# EAGLE design 8x LED Trieber Stage_01 (EAGLE 6.5.0)
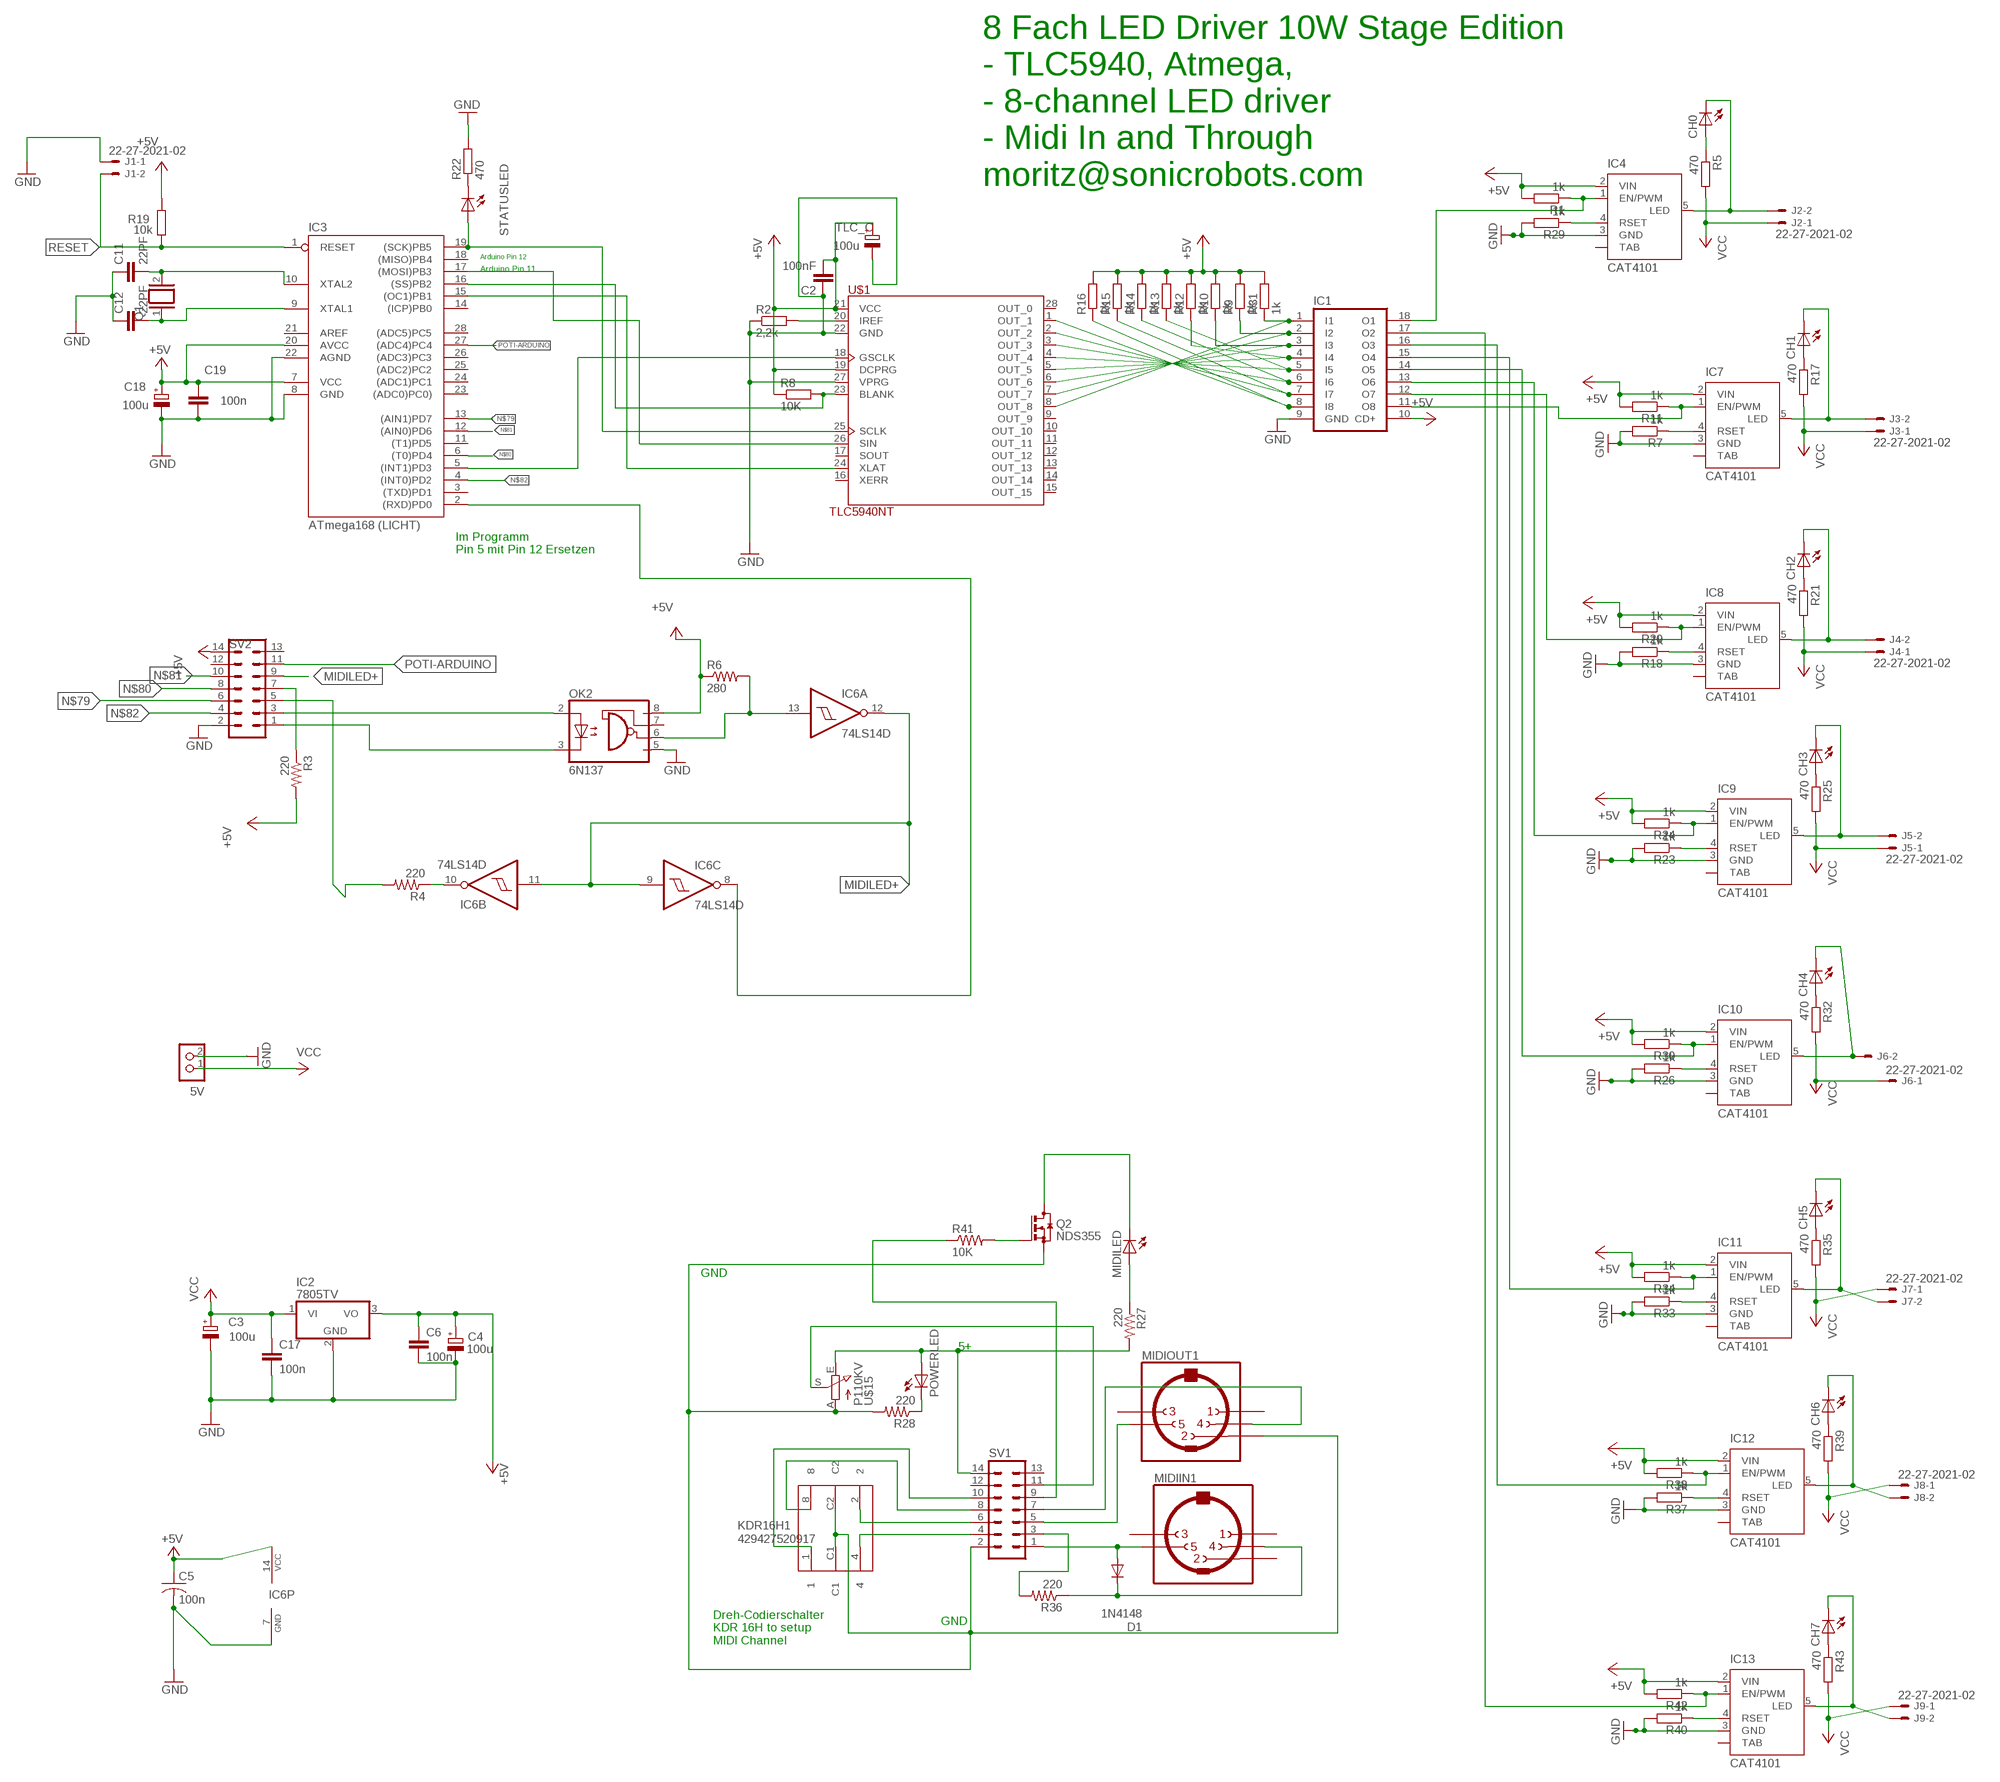
[diagram p0: schematic, sheet 1]

## Parts
5V  5V  CON_TERMINAL_BLOCK_02-5MM  [TERMINAL_BLOCK_2P_5]
C2  100nF  C-EUC0805  [C0805]
C3  100u  CPOL-EUE2.5-6  [E2,5-6]
C4  100u  CPOL-EUE2.5-6  [E2,5-6]
C5  100n  C-USC0805  [C0805]
C6  100n  C-EUC0805K  [C0805K]
C11  22PF  C-EUC0805  [C0805]
C12  22PF  C-EUC0805  [C0805]
C17  100n  C-EUC0805K  [C0805K]
C18  100u  CPOL-EUE2.5-6  [E2,5-6]
C19  100n  C-EUC0805K  [C0805K]
CH0  LED3MM  [LED3MM]
CH1  LED3MM  [LED3MM]
CH2  LED3MM  [LED3MM]
CH3  LED3MM  [LED3MM]
CH4  LED3MM  [LED3MM]
CH5  LED3MM  [LED3MM]
CH6  LED3MM  [LED3MM]
CH7  LED3MM  [LED3MM]
D1  1N4148  DIODE-D-7.5  [D-7.5]
IC1  IC_ULN2803AN  [DIL18]
IC2  7805TV  [TO220V]
IC3  ATmega168 (LICHT)  AT90S4433P  [DIL28-3]
IC4  CAT4101  [TO263_5]
IC6  74LS14D  [SO14]
IC7  CAT4101  [TO263_5]
IC8  CAT4101  [TO263_5]
IC9  CAT4101  [TO263_5]
IC10  CAT4101  [TO263_5]
IC11  CAT4101  [TO263_5]
IC12  CAT4101  [TO263_5]
IC13  CAT4101  [TO263_5]
J1  22-27-2021-02  [6410-02]
J2  22-27-2021-02  [6410-02]
J3  22-27-2021-02  [6410-02]
J4  22-27-2021-02  [6410-02]
J5  22-27-2021-02  [6410-02]
J6  22-27-2021-02  [6410-02]
J7  22-27-2021-02  [6410-02]
J8  22-27-2021-02  [6410-02]
J9  22-27-2021-02  [6410-02]
KDR16H1  429427520917  [429427520917]
MIDIIN1  MAB5SH  [MAB5SH]
MIDILED  LED3MM  [LED3MM]
MIDIOUT1  MAB5SH  [MAB5SH]
OK2  6N137  [DIL08]
POWERLED  LED3MM  [LED3MM]
Q1  XTAL/S  [QS]
Q2  NDS355  BSS123  [SOT23]
R1  1k  R-EU_R0805W  [R0805W]
R2  2,2k  R-EU_R0805  [R0805]
R3  220  R-US_R0805  [R0805]
R4  220  R-US_R0805  [R0805]
R5  470  R-EU_M0805  [M0805]
R6  280  R-US_R0805  [R0805]
R7  1k  R-EU_R0805W  [R0805W]
R8  10K  R-EU_R0805  [R0805]
R9  1k  R-EU_R0805W  [R0805W]
R10  1k  R-EU_R0805W  [R0805W]
R11  1k  R-EU_R0805W  [R0805W]
R12  1k  R-EU_R0805W  [R0805W]
R13  1k  R-EU_R0805W  [R0805W]
R14  1k  R-EU_R0805W  [R0805W]
R15  1k  R-EU_R0805W  [R0805W]
R16  1k  R-EU_R0805W  [R0805W]
R17  470  R-EU_M0805  [M0805]
R18  1k  R-EU_R0805W  [R0805W]
R19  10k  R-EU_R0805  [R0805]
R20  1k  R-EU_R0805W  [R0805W]
R21  470  R-EU_M0805  [M0805]
R22  470  R-EU_M0805  [M0805]
R23  1k  R-EU_R0805W  [R0805W]
R24  1k  R-EU_R0805W  [R0805W]
R25  470  R-EU_M0805  [M0805]
R26  1k  R-EU_R0805W  [R0805W]
R27  220  R-US_R0805W  [R0805W]
R28  220  R-US_R0805  [R0805]
R29  1k  R-EU_R0805W  [R0805W]
R30  1k  R-EU_R0805W  [R0805W]
R31  1k  R-EU_R0805W  [R0805W]
R32  470  R-EU_M0805  [M0805]
R33  1k  R-EU_R0805W  [R0805W]
R34  1k  R-EU_R0805W  [R0805W]
R35  470  R-EU_M0805  [M0805]
R36  220  R-US_R0805  [R0805]
R37  1k  R-EU_R0805W  [R0805W]
R38  1k  R-EU_R0805W  [R0805W]
R39  470  R-EU_M0805  [M0805]
R40  1k  R-EU_R0805W  [R0805W]
R41  10K  R-US_R0805  [R0805]
R42  1k  R-EU_R0805W  [R0805W]
R43  470  R-EU_M0805  [M0805]
STATUSLED  LED3MM  [LED3MM]
SV1  ML14  [ML14]
SV2  ML14  [ML14]
TLC_C  100u  CPOL-EUE2.5-6  [E2,5-6]
U$1  TLC5940NT  [DIP-28]
U$15  P110KV  [POT-P110KV]

## Nets
+5V [power]: C2.2 C4.+ C5.1 C6.1 C18.+ C19.1 IC1.10(CD+) IC2.3(VO) IC3.7(VCC) IC3.20(AVCC) IC4.2(VIN) IC6.14(P:VCC) IC7.2(VIN) IC8.2(VIN) IC9.2(VIN) IC10.2(VIN) IC11.2(VIN) IC12.2(VIN) IC13.2(VIN) OK2.8(VCC) R1.2 R3.2 R6.1 R8.1 R9.2 R10.2 R11.2 R12.2 R13.2 R14.2 R15.2 R16.2 R19.2 R20.2 R24.2 R30.2 R31.2 R34.2 R38.2 R42.2 SV2.14 TLC_C.+ U$1.19(DCPRG) U$1.21(VCC)
GND [power]: 5V.2 C2.1 C3.- C4.- C5.2 C6.2 C11.1 C12.1 C17.2 C18.- C19.2 IC1.9(GND) IC2.2(GND) IC3.8(GND) IC3.22(AGND) IC4.3(GND) IC6.7(P:GND) IC7.3(GND) IC8.3(GND) IC9.3(GND) IC10.3(GND) IC11.3(GND) IC12.3(GND) IC13.3(GND) J1.1 OK2.5(GND) R2.1 R7.2 R18.2 R22.2 R23.2 R26.2 R29.2 R33.2 R37.2 R40.2 SV2.2 TLC_C.- U$1.22(GND) U$1.27(VPRG)
MIDI-2: IC3.2((RXD)PD0) IC6.8(C:O)
MIDI_IN2: R41.1 SV1.9
MIDILED+: IC6.9(C:I) IC6.11(B:I) IC6.12(A:O) SV2.9
MIDILED+1: MIDILED.K(C) Q2.3(D)
N$1: OK2.3(C) SV2.1
N$2: IC6.13(A:I) OK2.6(VO) R6.2
N$3: IC1.1(I1) R31.1 U$1.8(OUT_8)
N$4: IC3.19((SCK)PB5) STATUSLED.A U$1.25(SCLK)
N$5: IC1.2(I2) R9.1 U$1.7(OUT_7)
N$6: IC1.3(I3) R10.1 U$1.6(OUT_6)
N$7: IC1.4(I4) R12.1 U$1.5(OUT_5)
N$8: IC3.17((MOSI)PB3) U$1.26(SIN)
N$9: IC3.16((SS)PB2) R8.2 U$1.23(BLANK)
N$10: IC7.4(RSET) R7.1
N$12: IC1.5(I5) R13.1 U$1.4(OUT_4)
N$13: IC1.6(I6) R14.1 U$1.3(OUT_3)
N$14: IC1.7(I7) R15.1 U$1.2(OUT_2)
N$15: IC3.15((OC1)PB1) U$1.24(XLAT)
N$16: IC1.11(O8) IC7.1(EN/PWM) R11.1
N$17: IC3.5((INT1)PD3) U$1.18(GSCLK)
N$18: IC1.8(I8) R16.1 U$1.1(OUT_1)
N$19: D1.A MIDIIN1.5 SV1.1
N$20: R2.2 U$1.20(IREF)
N$21: KDR16H1.1 SV1.10
N$22: C12.2 IC3.9(XTAL1) Q1.1
N$23: MIDILED.A R27.1
N$24: CH1.K(C) IC7.5(LED) J3.2
N$25: C11.2 IC3.10(XTAL2) Q1.2
N$26: R3.1 SV2.7
N$27: R22.1 STATUSLED.K(C)
N$29: IC4.4(RSET) R29.1
N$30: CH0.A R5.1
N$31: IC1.18(O1) IC4.1(EN/PWM) R1.1
N$32: IC6.10(B:O) R4.1
N$33: R4.2 SV2.5
N$34: SV1.11 U$15.S
N$35: D1.C MIDIIN1.4 R36.1
N$36: CH0.K(C) IC4.5(LED) J2.2
N$37: POWERLED.K(C) R28.1
N$38: CH1.A R17.1
N$39: IC8.4(RSET) R18.1
N$41: IC1.12(O7) IC8.1(EN/PWM) R20.1
N$42: CH2.K(C) IC8.5(LED) J4.2
N$43: MIDIOUT1.5 SV1.5
N$44: CH2.A R21.1
N$45: IC9.4(RSET) R23.1
N$47: IC1.13(O6) IC9.1(EN/PWM) R24.1
N$49: OK2.2(A) SV2.3
N$50: CH3.K(C) IC9.5(LED) J5.2
N$51: MIDIOUT1.4 SV1.7
N$52: CH3.A R25.1
N$53: IC10.4(RSET) R26.1
N$55: IC1.14(O5) IC10.1(EN/PWM) R30.1
N$56: CH4.K(C) IC10.5(LED) J6.2
N$57: CH4.A R32.1
N$58: IC11.4(RSET) R33.1
N$61: KDR16H1.4 SV1.4
N$62: IC1.15(O4) IC11.1(EN/PWM) R34.1
N$63: KDR16H1.8 SV1.8
N$64: KDR16H1.2 SV1.6
N$65: CH5.K(C) IC11.5(LED) J7.2
N$66: CH5.A R35.1
N$67: POWERLED.A R27.2 SV1.14 U$15.E
N$68: IC12.4(RSET) R37.1
N$70: IC1.16(O3) IC12.1(EN/PWM) R38.1
N$71: R36.2 SV1.3
N$72: CH6.K(C) IC12.5(LED) J8.2
N$73: CH6.A R39.1
N$74: Q2.1(G) R41.2
N$75 [power]: KDR16H1.C1 KDR16H1.C2 MIDIOUT1.2 Q2.2(S) R28.2 SV1.2 U$15.A
N$76: IC13.4(RSET) R40.1
N$78: IC1.17(O2) IC13.1(EN/PWM) R42.1
N$79: IC3.13((AIN1)PD7) SV2.6
N$80: IC3.6((T0)PD4) SV2.8
N$81: IC3.12((AIN0)PD6) SV2.10
N$82: IC3.4((INT0)PD2) SV2.4
N$83: CH7.K(C) IC13.5(LED) J9.2
N$84: CH7.A R43.1
POTI-ARDUINO: IC3.27((ADC4)PC4) SV2.11
RESET: IC3.1(RESET) J1.2 R19.1
VCC: 5V.1 C3.+ C17.1 IC2.1(VI) J2.1 J3.1 J4.1 J5.1 J6.1 J7.1 J8.1 J9.1 R5.2 R17.2 R21.2 R25.2 R32.2 R35.2 R39.2 R43.2
Unconnected: IC3.3((TXD)PD1) IC3.11((T1)PD5) IC3.14((ICP)PB0) IC3.18((MISO)PB4) IC3.21(AREF) IC3.23((ADC0)PC0)) IC3.24((ADC1)PC1) IC3.25((ADC2)PC2) IC3.26((ADC3)PC3) IC3.28((ADC5)PC5) IC4.TAB IC6.1(D:I) IC6.2(D:O) IC6.3(E:I) IC6.4(E:O) IC6.5(F:I) IC6.6(F:O) IC7.TAB IC8.TAB IC9.TAB IC10.TAB IC11.TAB IC12.TAB IC13.TAB MIDIIN1.1 MIDIIN1.2 MIDIIN1.3 MIDIOUT1.1 MIDIOUT1.3 OK2.7(VE) SV1.12 SV1.13 SV2.12 SV2.13 U$1.9(OUT_9) U$1.10(OUT_10) U$1.11(OUT_11) U$1.12(OUT_12) U$1.13(OUT_13) U$1.14(OUT_14) U$1.15(OUT_15) U$1.16(XERR) U$1.17(SOUT) U$1.28(OUT_0)

## Notes on the sheet
- 8 Fach LED Driver 10W Stage Edition
  - TLC5940, Atmega, 
  - 8-channel LED driver
  - Midi In and Through
  moritz@sonicrobots.com
- Arduino Pin 12
- Arduino Pin 11
- Im Programm
  Pin 5 mit Pin 12 Ersetzen
- GND
- 5+
- GND
- Dreh-Codierschalter 
  KDR 16H to setup 
  MIDI Channel

## Library data of the parts
5V = dp_devices:CON_TERMINAL_BLOCK_02: 2 poles wire to board terminal block
C2 C11 C12 = rcl:C-EU: CAPACITOR, European symbol
C3 C4 C18 TLC_C = my-rcl:CPOL-EU: POLARIZED CAPACITOR, European symbol
C5 = rcl:C-US: CAPACITOR, American symbol
C6 C17 C19 = my-rcl:C-EU: CAPACITOR, European symbol
CH0 CH1-CH7 MIDILED POWERLED STATUSLED = led:LED: LED OSRAM: - CHIPLED LG R971, LG N971, LY N971, LG Q971, LY Q971, LO R971, LY R971 LH N974, LH R974 LS Q976, LO Q976, LY Q976 LO Q996 - Hyper CHIPLED LW Q18S LB Q993, LB Q99A, LB R99A - SideLED LS A670, LO A670, LY A670, LG A670, LP A670 LB A673, LV A673, LT A673, LW A673 LH A674 LY A675 LS A676, LA A676, LO A676, LY A676, LW A676 LS A679, LY A679, LG A679 - Hyper Micro SIDELED® LS Y876, LA Y876, LO Y876, LY Y876 LT Y87S - SmartLED LW L88C, LW L88S LB L89C, LB L89S, LG L890 LS L89K, LO L89K, LY L89K LS L896, LA L896, LO L896, LY L896 - TOPLED LS T670, LO T670, LY T670, LG T670, LP T670 LSG T670, LSP T670, LSY T670, LOP T670, LYG T670 LG T671, LOG T671, LSG T671 LB T673, LV T673, LT T673, LW T673 LH T674 LS T676, LA T676, LO T676, LY T676, LB T676, LH T676, LSB T676, LW T676 LB T67C, LV T67C, LT T67C, LS T67K, LO T67K, LY T67K, LW E67C LS E67B, LA E67B, LO E67B, LY E67B, LB E67C, LV E67C, LT E67C LW T67C LS T679, LY T679, LG T679 LS T770, LO T770, LY T770, LG T770, LP T770 LB T773, LV T773, LT T773, LW T773 LH T774 LS E675, LA E675, LY E675, LS T675 LS T776, LA T776, LO T776, LY T776, LB T776 LHGB T686 LT T68C, LB T68C - Hyper Mini TOPLED® LB M676 - Mini TOPLED Santana® LG M470 LS M47K, LO M47K, LY M47K Source: http://www.osram.convergy.de LUXEON: - LUMILED® LXK2-PW12-R00, LXK2-PW12-S00, LXK2-PW14-U00, LXK2-PW14-V00 LXK2-PM12-R00, LXK2-PM12-S00, LXK2-PM14-U00 LXK2-PE12-Q00, LXK2-PE12-R00, LXK2-PE12-S00, LXK2-PE14-T00, LXK2-PE14-U00 LXK2-PB12-K00, LXK2-PB12-L00, LXK2-PB12-M00, LXK2-PB14-N00, LXK2-PB14-P00, LXK2-PB14-Q00 LXK2-PR12-L00, LXK2-PR12-M00, LXK2-PR14-Q00, LXK2-PR14-R00 LXK2-PD12-Q00, LXK2-PD12-R00, LXK2-PD12-S00 LXK2-PH12-R00, LXK2-PH12-S00 LXK2-PL12-P00, LXK2-PL12-Q00, LXK2-PL12-R00 Source: www.luxeon.com KINGBRIGHT: KA-3528ASYC Source: www.kingbright.com
D1 = diode:DIODE-: DIODE
IC1 = dp_devices:IC_ULN2803A: DRIVER ARRAY
IC2 = linear:78*: Positive VOLTAGE REGULATOR Source: http://cache.national.com/ds/LM/LM78L05.pdf http://www.fairchildsemi.com/ds/LM/LM7805.pdf
IC3 = atmel:AT90S4433: MICROCONTROLLER 4 Kbytes FLASH 128 bytes SRAM 256 bytes EEPROM UART 6-channel 10 bit ADC
IC4 IC7-IC13 = on-semiconductor:CAT4101: 1A Constant-Current LED Driver with PWM Dimming Source: ON Semiconductor .. 4101.pdf; MPN: CAT4101TV-T75; OC_FARNELL: 1718452; OC_NEWARK: 08R5264
IC6 = 74xx-us:74*14: Hex schmitt trigger INVERTER
J1-J9 = con-molex:22-?-02: CONNECTOR wire to board 2.54 mm (.1 inch) pitch header; OC_FARNELL: unknown; OC_NEWARK: unknown
KDR16H1 = Eagle_Wuerth_Elektronik_Switch:429427520917: WS-RCT, 10*10mm Rotary Switch, right angle type, THT, 16 position, 5,08mm, 6 pins, round Cross type, ivory, complement code
MIDIIN1 MIDIOUT1 = og-midi:MAB5SH: Female CONNECTOR 5 pins 90 deg. with shield, horizontal (DIN 41524)
OK2 = optocoupler:6N137: MOTOROLA OPTO COUPLER; MPN: 6N137; OC_FARNELL: 1328376; OC_NEWARK: 52M1895
Q1 = special:XTAL/S: CRYSTAL
Q2 = transistor-small-signal:BSS123: N-CHANNEL MOS FET
R1 R2 R5 R7-R26 R29-R35 R37-R40 R42 R43 = rcl:R-EU_: RESISTOR, European symbol
R3 R4 R6 R27 R28 R36 R41 = rcl:R-US_: RESISTOR, American symbol
SV1 SV2 = con-harting-ml:ML14: HARTING; OC_FARNELL: unknown; OC_NEWARK: unknown
U$1 = tlc5940:TLC5940
U$15 = Moritz_02:P110KV

## Net classes
1 power: width 0.6 mm, clearance 0.3 mm

## Board
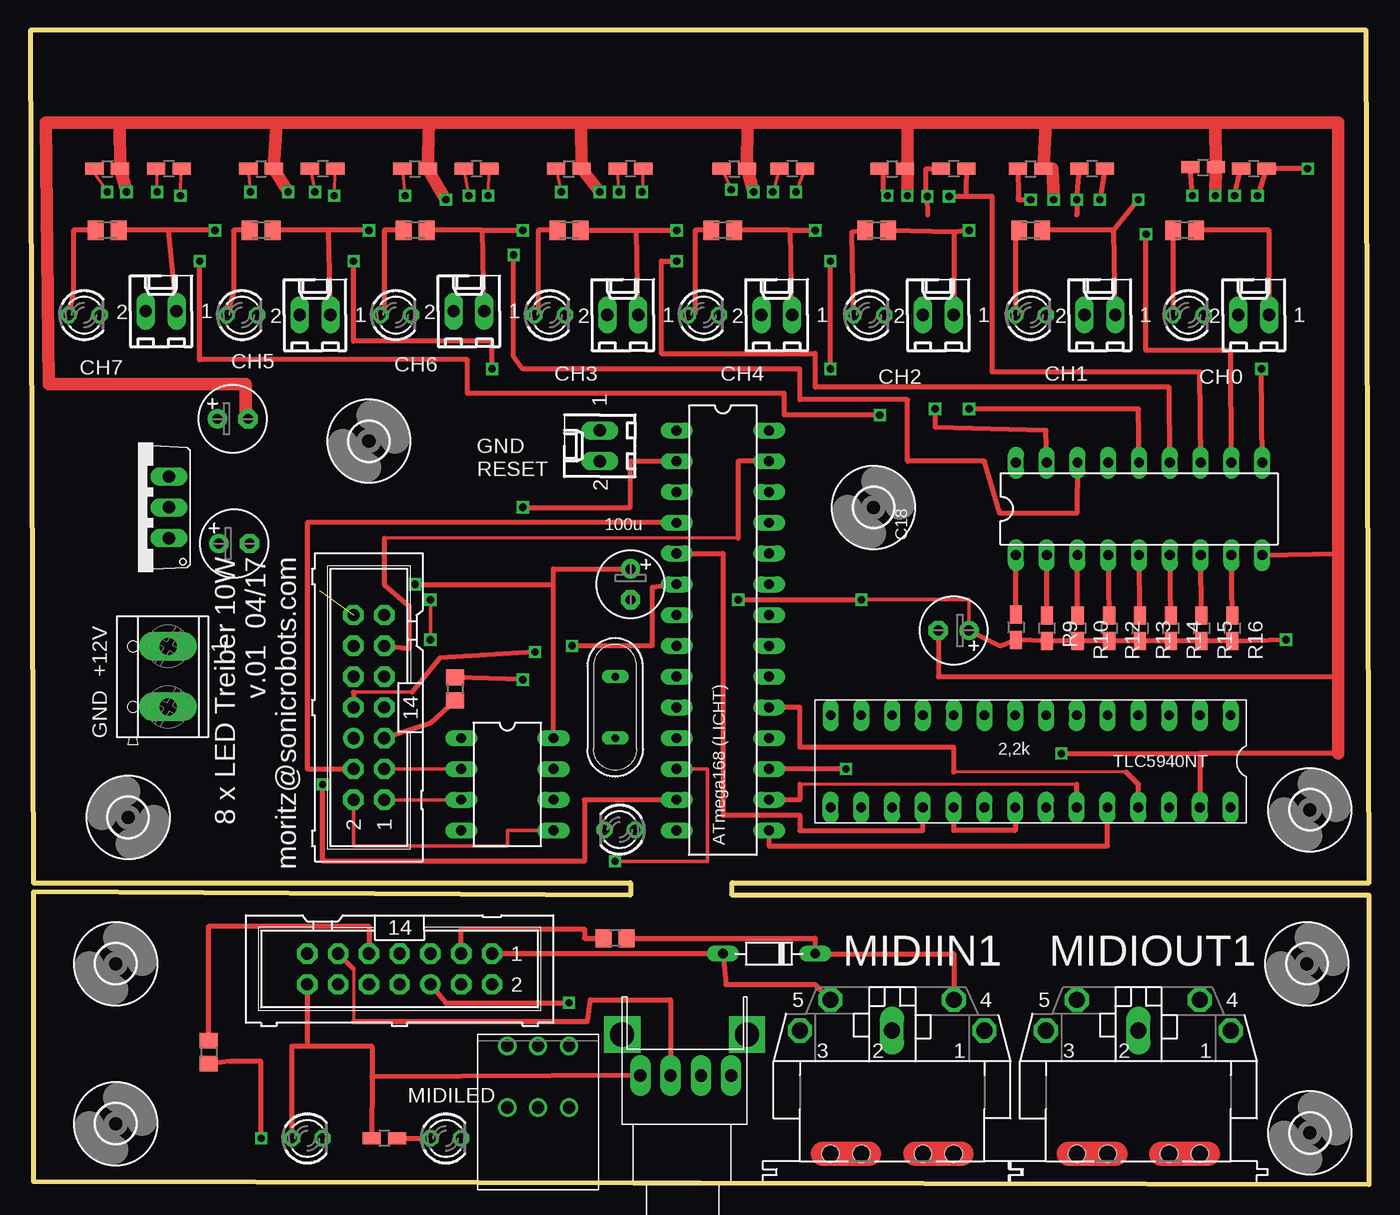
[diagram p1: board, top side]
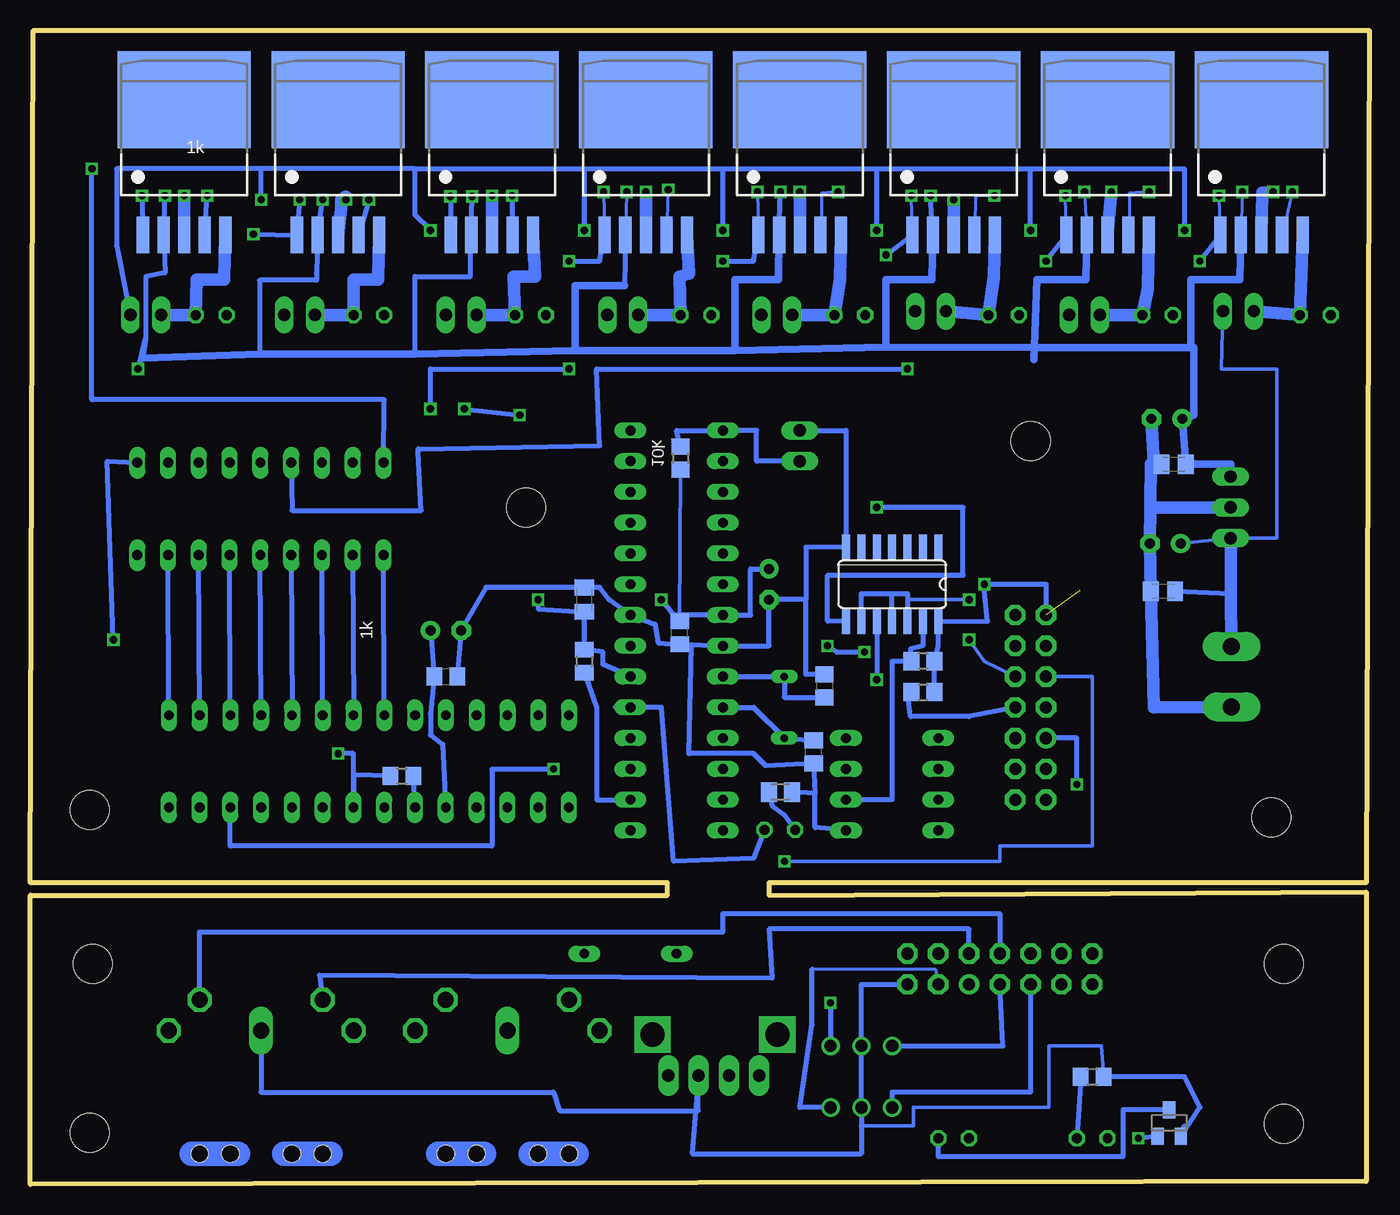
[diagram p2: board, bottom side, seen from below]

Size 110.49 x 95.25 mm. Coordinates in mm from the lower left corner, seen from the top.
Outline: 110.24,95.25 0,95.25 0.25,24.89 49.53,24.89 49.53,23.88 0.25,24.13 0.25,0.25 110.49,0 110.49,23.88 57.91,23.88 57.91,24.89 110.49,24.89 110.24,95.25
Copper layers (1*16): Top 0.035mm / dielectric 1.5mm / Bottom 0.035mm
Design rules "default": minimum track width 10mil, minimum drill 24mil, track to track 8mil, track to pad 8mil, pad to pad 8mil, via to via 8mil, smd to smd 8mil, copper to edge 40mil, drill to drill 8mil, minimum pad ring 10mil, minimum via ring 8mil, stop-mask expansion 4mil, vias tented up to drill 0mil, thermal gap 10mil

### Footprints (pad centres in the part's own frame; a part is rotated, then mirrored left to right if it is on the bottom)
TERMINAL_BLOCK_2P_5 = drill 1.4 pad 2.38 long: 1 2.5,-0.45; 2 -2.5,-0.45
C0805 = smd 1.3 x 1.5: 1 -0.95,0; 2 0.95,0
E2,5-6 = drill 0.813 pad 1.6: + -1.27,0 | drill 0.813 pad 1.6 octagon: - 1.27,0
C0805K = smd 1.3 x 1.6: 1 -1,0; 2 1,0
LED3MM = drill 0.813 octagon: A -1.27,0; K 1.27,0
D-7.5 = drill 0.813 long: A 3.81,0; C -3.81,0
DIL18 = drill 0.813 long: 1 -10.16,-3.81; 2 -7.62,-3.81; 3 -5.08,-3.81; 4 -2.54,-3.81; 5 0,-3.81; 6 2.54,-3.81; 7 5.08,-3.81; 8 7.62,-3.81; 9 10.16,-3.81; 10 10.16,3.81; 11 7.62,3.81; 12 5.08,3.81; 13 2.54,3.81; 14 0,3.81; 15 -2.54,3.81; 16 -5.08,3.81; 17 -7.62,3.81; 18 -10.16,3.81
TO220V = drill 1.016 long: 1 -2.54,-2.54; 2 0,-2.54; 3 2.54,-2.54
DIL28-3 = drill 0.813 long: 1 -16.51,-3.81; 2 -13.97,-3.81; 3 -11.43,-3.81; 4 -8.89,-3.81; 5 -6.35,-3.81; 6 -3.81,-3.81; 7 -1.27,-3.81; 8 1.27,-3.81; 9 3.81,-3.81; 10 6.35,-3.81; 11 8.89,-3.81; 12 11.43,-3.81; 13 13.97,-3.81; 14 16.51,-3.81; 15 16.51,3.81; 16 13.97,3.81; 17 11.43,3.81; 18 8.89,3.81; 19 6.35,3.81; 20 3.81,3.81; 21 1.27,3.81; 22 -1.27,3.81; 23 -3.81,3.81; 24 -6.35,3.81; 25 -8.89,3.81; 26 -11.43,3.81; 27 -13.97,3.81; 28 -16.51,3.81
TO263_5 = smd 1 x 3: 1 -3.4,-8; 2 -1.7,-8; 3 0,-8; 4 1.7,-8; 5 3.4,-8 | smd 11 x 8: TAB 0,3.175
SO14 = smd 0.66 x 2.032: 1 -3.81,-3.073; 2 -2.54,-3.073; 3 -1.27,-3.073; 4 0,-3.073; 5 1.27,-3.073; 6 2.54,-3.073; 7 3.81,-3.073; 8 3.81,3.073; 9 2.54,3.073; 10 1.27,3.073; 11 0,3.073; 12 -1.27,3.073; 13 -2.54,3.073; 14 -3.81,3.073
6410-02 = drill 1.016 long: 1 1.27,0; 2 -1.27,0
429427520917 = drill 1: 1 -2.54,-2.54; 2 2.54,2.54; 4 2.54,-2.54; 8 -2.54,2.54; C1 0,-2.54; C2 0,2.54
MAB5SH = drill 1.321 octagon: 1 7.62,7.62; 3 -7.62,7.62; 4 5.08,10.16; 5 -5.08,10.16 | drill 1.321 long: 2 0,7.62 | hole 1.4: 2.54,-2.54; -2.54,-2.54; -5.08,-2.54; 5.08,-2.54
DIL08 = drill 0.813 long: 1 -3.81,-3.81; 2 -1.27,-3.81; 3 1.27,-3.81; 4 3.81,-3.81; 5 3.81,3.81; 6 1.27,3.81; 7 -1.27,3.81; 8 -3.81,3.81
QS = drill 0.61 long: 1 -2.54,0; 2 2.54,0
SOT23 = smd 1 x 1.4: 1 -0.95,-1.1; 2 0.95,-1.1; 3 0,1.1
R0805W = smd 1.5 x 1: 1 -1.052,0; 2 1.052,0
R0805 = smd 1.3 x 1.5: 1 -0.95,0; 2 0.95,0
M0805 = smd 1.3 x 1.6: 1 -0.95,0; 2 0.95,0
ML14 = drill 1 pad 1.676 octagon: 1 -7.62,-1.27; 2 -7.62,1.27; 3 -5.08,-1.27; 4 -5.08,1.27; 5 -2.54,-1.27; 7 0,-1.27; 8 0,1.27; 9 2.54,-1.27; 10 2.54,1.27; 11 5.08,-1.27; 12 5.08,1.27; 13 7.62,-1.27; 14 7.62,1.27 | drill 1 pad 1.676: 6 -2.54,1.27
DIP-28 = drill 0.8 long: 1 -3.81,13.97; 2 -3.81,11.43; 3 -3.81,8.89; 4 -3.81,6.35; 5 -3.81,3.81; 6 -3.81,1.27; 7 -3.81,-1.27; 8 -3.81,-3.81; 9 -3.81,-6.35; 10 -3.81,-8.89; 11 -3.81,-11.43; 12 -3.81,-13.97; 13 -3.81,-16.51; 14 -3.81,-19.05; 15 3.81,-19.05; 16 3.81,-16.51; 17 3.81,-13.97; 18 3.81,-11.43; 19 3.81,-8.89; 20 3.81,-6.35; 21 3.81,-3.81; 22 3.81,-1.27; 23 3.81,1.27; 24 3.81,3.81; 25 3.81,6.35; 26 3.81,8.89; 27 3.81,11.43; 28 3.81,13.97
3,2 = hole 3.2: 0,0
POT-P110KV = drill 1 pad 1.676 long: A -4.98,-2; E -4.98,3; NA -4.98,-4.5; S -4.98,0.5 | drill 2 pad 2.8 square: M1 -1.6,4.5; M2 -1.6,-5.8

### Placement (x,y rotation side)
5V  10.92,41.91 90 top
C2  56.9,45.53 90 bottom
C3  16.83,52.9 0 top
C4  16.7,63.18 0 top
C5  76.2,41.91 0 bottom
C6  16.13,59.44 180 bottom
C11  45.85,35.69 90 bottom
C12  44.96,41.15 270 bottom
C17  17.02,48.96 180 bottom
C18  49.53,49.53 270 top
C19  64.77,48.26 90 bottom
CH0  95.57,71.75 0 top
CH1  82.55,71.75 0 top
CH2  69.22,71.75 0 top
CH3  42.86,71.75 0 top
CH4  55.56,71.75 0 top
CH5  17.46,71.75 0 top
CH6  30.16,71.75 0 top
CH7  4.45,71.75 0 top
D1  60.96,19.05 180 top
IC1  91.5,55.75 0 top
IC2  8.89,55.88 90 top
IC3  57.15,45.72 270 top
IC4  97.79,86.36 0 bottom
IC6  39.37,49.53 180 bottom
IC7  85.09,86.36 0 bottom
IC8  72.39,86.36 0 bottom
IC9  46.99,86.36 0 bottom
IC10  59.69,86.36 0 bottom
IC11  21.59,86.36 0 bottom
IC12  34.29,86.36 0 bottom
IC13  8.89,86.36 0 bottom
J1  46.99,60.96 90 top
J2  100.97,71.75 0 top
J3  88.27,71.75 0 top
J4  74.93,71.75 0 top
J5  48.89,71.75 0 top
J6  61.59,71.75 0 top
J7  23.49,71.75 0 top
J8  36.19,72.07 0 top
J9  10.79,72.07 0 top
KDR16H1  41.91,8.89 0 top
MIDIIN1  71.12,5.08 0 top
MIDILED  34.29,3.81 0 top
MIDIOUT1  91.44,5.08 0 top
OK2  39.37,33.02 270 top
POWERLED  22.86,3.81 0 top
Q1  48.26,39.37 270 top
Q2  16.51,5.08 0 bottom
R1  100.97,83.82 180 top
R2  79.82,33.72 0 bottom
R3  36.83,40.64 0 bottom
R4  35.05,40.89 270 top
R5  95.25,78.74 0 top
R6  36.83,43.18 180 bottom
R7  82.55,83.82 0 top
R8  64.77,43.18 270 bottom
R9  83.88,45.91 270 top
R10  86.42,45.91 270 top
R11  87.63,83.82 180 top
R12  89.03,45.91 270 top
R13  91.57,45.91 270 top
R14  94.11,45.91 270 top
R15  96.65,45.91 270 top
R16  99.19,45.91 270 top
R17  82.55,78.74 0 top
R18  71.12,83.82 0 top
R19  56.83,59.94 270 bottom
R20  76.2,83.82 180 top
R21  69.85,78.74 0 top
R22  48.58,32.39 0 bottom
R23  44.45,83.82 0 top
R24  49.53,83.82 180 top
R25  44.45,78.74 0 top
R26  58.1,83.82 0 top
R27  29.21,3.81 180 top
R28  22.86,8.89 0 bottom
R29  96.77,83.95 0 top
R30  62.86,83.82 180 top
R31  81.34,45.97 270 top
R32  57.15,78.74 0 top
R33  19.05,83.82 0 top
R34  24.13,83.82 180 top
R35  19.05,78.74 0 top
R36  48.26,20.32 180 top
R37  31.75,83.82 0 top
R38  36.83,83.82 180 top
R39  31.75,78.74 0 top
R40  6.35,83.82 0 top
R41  14.73,10.92 270 top
R42  11.43,83.82 180 top
R43  6.35,78.74 0 top
STATUSLED  48.64,29.27 180 top
SV1  30.48,17.78 180 top
SV2  27.94,39.37 90 top
TLC_C  76.2,45.72 180 top
U$1  85.09,34.93 270 top
U$2  [3,2]  8.06,30.29 270 top
U$3  [3,2]  105.6,30.92 0 top
U$4  [3,2]  69.6,55.88 0 top
U$5  [3,2]  105.6,4.25 0 top
U$6  [3,2]  27.94,61.34 0 top
U$7  [3,2]  105.35,18.22 0 top
U$8  [3,2]  7.05,18.22 0 top
U$9  [3,2]  7.05,5.02 0 top
U$15  53.34,13.97 90 top

### Tracks (layer width: path | path; a pad name or v marks a point on that pad's centre or on a via)
+5V  (via drill 0.6)  (1 unrouted)
  Top 0.254: R30.2 v61.28,81.91 | v48.58,81.91 R24.2 | v36.19,81.6 R38.2 | R34.2 v23.49,81.91 | R42.2 v10.48,81.91
  Top 0.305: TLC_C.+ 77.47,48.26 v68.58,48.26
  Top 0.406: R20.2 73.91,83.82 73.91,81.53 v74.04,81.53 74.07,80.02 | 86.36,80.01 v86.36,81.28 R11.2 | v99.38,81.6 R1.2 | IC1.10 v101.6,67.31 | U$1.21 81.28,29.21 76.2,29.21 U$1.19 | TLC_C.+ 80.01,44.45 R31.2 R9.2 R10.2 R12.2 R13.2 R14.2 R15.2 R16.2 v103.63,44.96 | OK2.8 43.18,49.53 | 43.18,49.53 43.18,50.8 C18.+ | v31.75,49.53 43.18,49.53 | v58.42,48.26 v68.58,48.26
  Bottom 0.254: v61.28,81.91 IC10.2 | v23.49,81.91 IC11.2 | v10.48,81.91 IC13.2
  Bottom 0.305: R19.2 C2.2
  Bottom 0.406: v74.04,81.53 74.1,78.36 IC8.2 74.17,78.74 74.17,74.93 78.74,74.93 78.74,68.52 | v86.36,81.28 IC7.2 86.87,75.18 86.87,74.61 91.57,74.61 91.57,68.52 | v99.38,81.6 IC4.2 99.38,75.25 100.97,74.93 100.97,69.85 | 100.97,69.85 101.22,68.2 | v101.6,67.31 100.97,69.85 | IC10.2 61.47,74.17 | 27.69,68.07 27.7,69.08 | 14.73,69.09 14.49,69.08 | TLC_C.+ C5.1 77.47,38.86 77.47,37.08 76.45,36.32 U$1.19 | v103.63,44.96 104.14,59.69 IC1.10 | C18.+ 51.05,50.8 51.05,46.99 IC3.7 57.15,46.99 C2.2 v58.42,48.26 | R3.2 R6.1 35.56,44.45 IC6.14 31.5,46.48 31.75,49.02 v31.75,49.53 26.67,49.53 SV2.14 | IC3.20 63.25,42.93 63.25,43.94 R8.1 C19.1 68.58,47.5 v68.58,48.26 | IC9.2 v48.58,81.91 | IC12.2 v36.19,81.6
  Bottom 0.61: 101.22,68.2 91.57,68.52 78.74,68.52 65.53,68.83 | 61.47,74.17 65.53,74.17 65.53,68.83 | IC9.2 48.77,74.68 52.32,74.68 52.32,68.83 | 52.32,68.83 65.53,68.83 | IC12.2 36.07,74.68 39.88,74.68 39.88,69.09 | 39.88,69.09 52.32,68.83 | IC11.2 23.37,74.68 27.43,74.68 27.69,68.07 | 39.88,69.09 27.7,69.08 14.49,69.08 14.48,63.5 C4.+ C6.1 11.43,59.44 IC2.3 | IC13.2 10.67,74.68 14.73,74.68 14.73,69.09
GND  (via drill 0.6)
  Top 0.254: R7.2 84.33,83.82
  Top 0.305: OK2.5 39.37,29.21 39.37,27.94 26.67,27.94 SV2.2
  Top 0.406: R18.2 v72.39,81.6 | IC1.9 107.95,52.07 | TLC_C.- 74.93,41.91 107.95,41.91 | v85.09,35.56 96.52,35.56 | 96.52,35.56 U$1.27 | 107.95,35.56 96.52,35.56
  Top 1.016: 97.79,87.63 107.95,87.63 107.95,52.07 107.95,41.91 107.95,35.56 | 97.79,87.63 83.82,87.63 | 83.82,87.63 R7.2 | v72.39,81.6 72.39,87.63 | 72.39,87.63 83.82,87.63 | v59.69,81.91 R26.2 59.18,87.63 | v46.99,81.91 R23.2 45.47,87.63 | v34.29,81.28 R37.2 32.89,87.63 | v21.27,81.91 R33.2 20.32,87.63 | v7.94,81.91 R40.2 7.37,87.63 | 72.39,87.63 59.18,87.63 | 59.18,87.63 45.47,87.63 | 45.47,87.63 32.89,87.63 | 32.89,87.63 20.32,87.63 | 20.32,87.63 7.37,87.63 | 97.79,87.63 R29.2 v97.79,81.6 | C4.- 17.78,63.18 17.78,66.04 1.52,66.04 1.27,87.63 7.37,87.63 | 84.33,83.82 v84.45,81.28
  Bottom 0.406: C5.2 TLC_C.- 72.9,49.28 C19.2 63.5,49.28 62.74,48.26 IC3.22 | R2.1 83.82,33.78 U$1.22 83.82,35.56 v85.09,35.56 | J1.1 43.18,62.23 IC6.7 46.48,52.58 46.48,48.26 | 46.48,48.26 C18.- 49.53,44.45 IC3.8 55.92,44.54 | 55.92,44.54 C2.1 58.67,44.7 58.93,46.23 IC3.22 | C12.1 46.48,42.1 46.48,48.26 | 45.72,32.26 C11.1 49.78,34.54 50.8,35.56 56.13,35.56 55.92,44.54 | 45.72,32.26 R22.2 | OK2.5 45.72,29.46 45.72,32.26 | IC3.22 61.21,46.99 | C3.- 17.78,55.88
  Bottom 1.016: IC7.3 84.84,80.52 84.84,81.28 v84.45,81.28 84.45,81.53 | v72.39,81.6 IC8.3 | v97.79,81.6 IC4.3 | v59.69,81.91 IC10.3 | v46.99,81.91 IC9.3 | IC12.3 v34.29,81.28 | v21.27,81.91 IC11.3 | IC13.3 8.83,81.85 v7.94,81.91 | 5V.2 17.78,39.37 C17.2 C3.- 18.03,59.44 17.78,59.44 | 17.78,59.44 C6.2 | 17.78,55.88 IC2.2 | C4.- 17.78,59.44
MIDI-2  (via drill 0.6)
  Top 0.406: v40.64,55.88 49.53,55.88 49.53,59.69 IC3.2
  Bottom 0.406: IC6.8 44.7,46.48 44.7,50.29 33.53,50.29 33.53,55.88 v40.64,55.88
MIDI_IN2
  Top 0.406: R41.1 14.73,21.34 27.94,21.34 SV1.9
MIDILED+  (via drill 0.6)
  Top 0.305: v33.02,44.96 v33.02,48.26
  Bottom 0.305: SV2.9 31.75,43.18 v33.02,44.96 | v33.02,48.26 38.1,48.26
  Bottom 0.406: IC6.9 41.91,48.77 39.37,48.77 | 39.37,48.77 38.1,48.77 38.1,48.26 IC6.12 | IC6.11 39.37,48.77
MIDILED+1
  Bottom 0.406: Q2.3 20.32,6.18 20.32,2.29 35.56,2.29 MIDILED.K
N$1
  Top 0.305: SV2.1 OK2.3
N$2
  Bottom 0.406: IC6.13 36.83,44.45 37.85,44.2 R6.2 39.37,43.18 39.37,31.75 OK2.6
N$3
  Top 0.406: R31.1 IC1.1
  Bottom 0.406: U$1.8 IC1.1
N$4
  Top 0.254: 90.42,34.04 76.2,34.04
  Top 0.406: U$1.25 91.44,33.02 90.42,34.04 | 76.2,34.04 76.2,36.07 63.5,36.07 63.5,39.37 IC3.19
  Bottom 0.406: STATUSLED.A 50.8,26.92 57.4,26.67 58.42,39.37 IC3.19 62.23,39.37
N$5
  Top 0.406: R9.1 IC1.2
  Bottom 0.406: IC1.2 U$1.7
N$6
  Top 0.406: R10.1 IC1.3
  Bottom 0.406: U$1.6 IC1.3
N$7
  Top 0.406: R12.1 IC1.4
  Bottom 0.406: IC1.4 U$1.5
N$8  (via drill 0.6)
  Top 0.406: v67.31,34.29 IC3.17
  Bottom 0.406: U$1.26 93.98,27.94 72.39,27.94 72.39,34.29 v67.31,34.29
N$9
  Top 0.254: 86.36,33.02 63.5,33.02
  Top 0.406: U$1.23 86.36,33.02 | 63.5,33.02 63.5,31.75 IC3.16
  Bottom 0.406: R8.2 63.75,39.37 63.75,31.75 IC3.16
N$10  (via drill 0.6)
  Top 0.406: R7.1 81.53,81.53 81.53,81.28 v82.55,81.28
  Bottom 0.406: v82.55,81.28 IC7.4
N$12
  Top 0.406: R13.1 IC1.5
  Bottom 0.406: U$1.4 IC1.5
N$13
  Top 0.406: R14.1 IC1.6
  Bottom 0.406: U$1.3 IC1.6
N$14
  Top 0.406: R15.1 IC1.7
  Bottom 0.406: U$1.2 IC1.7
N$15
  Top 0.406: IC3.15 60.96,27.94 88.9,27.94 U$1.24
N$16  (via drill 0.6)
  Top 0.406: R11.1 v88.27,81.28 | IC1.11 99.06,68.83 92.07,68.83 v92.07,78.42
  Bottom 0.406: v88.27,81.28 IC7.1 v92.07,78.42
N$17
  Top 0.406: IC3.5 57.15,52.07 57.15,30.48 63.5,30.48 63.5,29.21 73.66,29.21 U$1.18
N$18
  Top 0.406: R16.1 IC1.8
  Bottom 0.406: U$1.1 IC1.8
N$19
  Top 0.406: MIDIIN1.5 64.77,16.51 57.4,16.51 D1.A SV1.1
N$20
  Bottom 0.406: U$1.20 R2.2
N$21
  Bottom 0.406: SV1.10 27.94,7.62 39.37,7.62 KDR16H1.1
N$22
  Bottom 0.406: IC3.9 Q1.1 48.26,40.2 C12.2
N$23
  Top 0.406: R27.1 MIDILED.A
N$24
  Bottom 1.016: IC7.5 81.79,74.68 83.82,74.68 CH1.K J3.2
N$25
  Bottom 0.406: C11.2 Q1.2 50.8,39.37 IC3.10
N$26
  Bottom 0.406: SV2.7 33.02,38.61 37.85,38.61 38.1,40.64 R3.1
N$27
  Bottom 0.406: R22.1 49.28,31.24 48.26,30.48 STATUSLED.K
N$29  (via drill 0.6)
  Top 0.406: v95.88,81.6 R29.1
  Bottom 0.406: IC4.4 v95.88,81.6
N$30
  Top 0.406: R5.1 94.3,78.42 CH0.A
N$31  (via drill 0.6)
  Top 0.406: v101.28,81.6 R1.1 v105.41,83.82
  Bottom 0.406: v101.28,81.6 IC4.1 | IC1.18 81.28,64.77 105.41,64.77 v105.41,83.82
N$32  (via drill 0.6)
  Top 0.406: v40.64,41.66 R4.1
  Bottom 0.406: IC6.10 v40.64,41.66
N$33
  Top 0.406: SV2.5 33.02,38.1 R4.2
N$34
  Top 0.254: 26.67,17.78 26.67,13.46
  Top 0.406: SV1.11 26.67,17.78 | 26.67,13.46 45.97,13.46 46.23,15.24 52.83,15.24 U$15.S
N$35
  Top 0.406: R36.1 64.77,20.32 D1.C 76.2,19.05 MIDIIN1.4
N$36
  Bottom 1.016: J2.2 CH0.K 96.77,74.68 94.49,74.68 IC4.5
N$37
  Bottom 0.406: R28.1 POWERLED.K
N$38
  Top 0.406: R17.1 81.28,78.74 CH1.A
N$39  (via drill 0.6)
  Top 0.406: R18.1 70.36,83.82 70.36,82.04 v70.74,81.6
  Bottom 0.406: v70.74,81.6 IC8.4
N$41  (via drill 0.6)
  Top 0.406: R20.1 77.22,82.04 77.22,81.53 v75.82,81.53 79.38,81.53 79.38,67.06 96.52,67.06 IC1.12
  Bottom 0.406: v75.82,81.53 IC8.1
N$42
  Bottom 1.016: J4.2 CH2.K 70.61,74.93 68.83,74.93 IC8.5
N$43
  Bottom 0.406: SV1.5 33.02,21.08 49.53,21.08 49.28,17.02 86.61,17.27 MIDIOUT1.5
N$44
  Top 0.406: CH2.A 67.82,78.61 R21.1
N$45  (via drill 0.6)
  Top 0.254: R23.1 v43.81,81.91
  Bottom 0.254: v43.81,81.91 45.21,81.79 45.21,78.36 IC9.4
N$47  (via drill 0.6)
  Top 0.254: R24.1 v50.48,81.91
  Top 0.406: IC1.13 93.98,65.79 64.77,65.79 64.77,68.58 52.07,68.58 52.07,76.2 v53.34,76.2
  Bottom 0.254: v50.48,81.91 IC9.1
  Bottom 0.406: v53.34,76.2 50.8,76.2 IC9.1
N$49
  Top 0.305: SV2.3 OK2.2
N$50
  Bottom 1.016: IC9.5 43.69,74.68 CH3.K J5.2
N$51
  Bottom 0.406: MIDIOUT1.4 96.52,20.83 53.34,20.83 53.34,22.35 30.48,22.35 SV1.7
N$52
  Top 0.406: R25.1 41.91,78.74 41.91,72.39 CH3.A
N$53  (via drill 0.6)
  Top 0.254: R26.1 v57.85,82.11
  Bottom 0.254: v57.85,82.11 IC10.4
N$55  (via drill 0.6)
  Top 0.254: R30.1 v63.18,81.91
  Top 0.406: IC1.14 91.44,64.01 v77.47,64.01 | v66.04,67.31 v66.04,76.2
  Bottom 0.254: v63.18,81.91 IC10.1
  Bottom 0.406: v77.47,64.01 77.47,67.31 v66.04,67.31 | v66.04,76.2 63.5,76.2 IC10.1
N$56
  Bottom 1.016: J6.2 CH4.K 56.9,74.93 56.13,75.18 IC10.5
N$57
  Top 0.406: R32.1 54.86,78.74 54.86,71.88 CH4.A
N$58  (via drill 0.6)
  Top 0.254: R33.1 v18.16,81.91
  Bottom 0.254: v18.16,81.91 19.81,81.79 19.81,78.36 IC11.4
N$61
  Bottom 0.254: 45.97,17.78 35.81,17.78 SV1.4
  Bottom 0.406: KDR16H1.4 46.99,6.35 45.97,13.21 45.97,17.78
N$62  (via drill 0.6)
  Top 0.254: v25.08,81.6 R34.1
  Top 0.406: v38.1,67.31 38.1,69.6 26.67,69.6 v26.67,76.2
  Bottom 0.254: IC11.1 v25.08,81.6
  Bottom 0.406: IC1.15 88.9,55.63 78.23,55.63 78.49,60.45 78.49,60.71 63.5,60.96 63.75,67.31 v38.1,67.31 | v26.67,76.2 IC11.1
N$63
  Bottom 0.406: KDR16H1.8 30.23,11.43 SV1.8
N$64  (via drill 0.6)
  Top 0.406: SV1.6 34.29,14.99 v44.45,14.99
  Bottom 0.406: v44.45,14.99 KDR16H1.2
N$65
  Bottom 1.016: J7.2 CH5.K 18.29,73.91 IC11.5
N$66
  Top 0.406: R35.1 16.76,78.74 16.76,73.66 CH5.A
N$67
  Top 0.406: U$15.E 28.19,8.89 | 28.19,8.89 R27.2 | SV1.14 22.86,11.43 | 22.86,11.43 28.19,11.43 28.19,8.89 | POWERLED.A 21.59,11.43 22.86,11.43
N$68  (via drill 0.6)
  Top 0.254: R37.1 v30.92,81.6
  Bottom 0.254: v30.92,81.6 32.51,81.6 32.51,81.03 IC12.4
N$70  (via drill 0.6)
  Top 0.254: v37.78,81.6 R38.1
  Top 0.406: IC1.16 86.36,55.37 80.01,55.37 78.74,59.69 72.39,59.69 72.39,64.77 63.5,64.77 63.5,67.31 40.64,67.31 39.88,68.33 v39.88,76.71
  Bottom 0.254: IC12.1 v37.78,81.6
  Bottom 0.406: v39.88,76.71 IC12.1
N$71
  Top 0.406: SV1.3 35.56,21.08 45.72,21.08 45.72,20.32 R36.2
N$72
  Bottom 1.016: J8.2 CH6.K 30.99,74.93 IC12.5
N$73
  Top 0.406: R39.1 29.21,78.74 29.21,72.39 CH6.A
N$74  (via drill 0.6)
  Top 0.406: v19.05,3.81 19.05,10.16 16.51,10.16 R41.2
  Bottom 0.406: Q2.1 v19.05,3.81
N$75
  Bottom 0.305: 41.91,4.83 37.59,4.83 37.59,6.35 26.42,6.35 26.42,11.43 22.1,11.43 R28.2
  Bottom 0.406: MIDIOUT1.2 91.44,7.62 67.31,7.62 66.8,6.1 55.37,6.1 U$15.A 55.88,2.54 41.91,2.54 41.91,4.83 KDR16H1.C1 KDR16H1.C2 41.91,16.51 SV1.2 | 15.24,4.83 Q2.2 13.97,6.35 15.24,8.89 R28.2
N$76  (via drill 0.6)
  Top 0.254: R40.1 5.08,83.82 v6.35,81.91
  Bottom 0.254: v6.35,81.91 IC13.4
N$78  (via drill 0.6)
  Top 0.254: v12.38,81.6 R42.1
  Top 0.406: IC1.17 83.82,62.23 74.68,62.48 v74.68,64.01 | v70.1,63.5 62.23,63.5 62.23,65.28 36.07,65.28 36.07,68.07 13.97,68.07 v13.97,76.2
  Bottom 0.254: IC13.1 v12.38,81.6
  Bottom 0.406: v74.68,64.01 v70.1,63.5 | v13.97,76.2 IC13.1
N$79  (via drill 0.6)
  Top 0.406: IC3.13 45.72,31.75 45.72,26.67 24.13,26.67 v24.13,33.02
  Bottom 0.406: v24.13,33.02 24.13,36.83 SV2.6
N$80  (via drill 0.6)
  Top 0.305: 31.5,40.64 26.67,40.64
  Top 0.406: IC3.6 51.31,49.28 51.31,44.45 v44.7,44.45 | v41.66,43.94 33.78,43.43 31.5,40.64 | 26.67,40.64 SV2.8
  Bottom 0.406: v44.7,44.45 43.94,43.94 v41.66,43.94
N$81  (via drill 0.6)
  Top 0.305: v48.26,26.67 55.88,26.67 55.88,34.29 IC3.12
  Bottom 0.305: SV2.10 22.86,41.91 22.86,27.94 30.48,27.94 30.48,26.67 v48.26,26.67
N$82
  Top 0.406: IC3.4 22.86,54.61 22.86,34.29 SV2.4
N$83
  Bottom 1.016: J9.2 CH7.K IC13.5
N$84
  Top 0.406: R43.1 3.56,78.74 3.56,73.66 CH7.A
POTI-ARDUINO
  Top 0.254: 58.42,53.34 29.21,53.34
  Top 0.406: IC3.27 58.42,59.69 58.42,53.34 | 29.21,53.34 29.21,49.53 31.24,47.75 31.24,44.2 SV2.11
RESET
  Bottom 0.406: R19.1 57.15,62.23 IC3.1 50.55,62.23 50.55,59.69 J1.2
VCC  (via drill 0.6)
  Top 0.406: R21.2 76.2,78.61 | 76.2,78.61 J4.1 | J3.1 89.41,78.74 | 89.41,78.74 R17.2 | J2.1 102.23,78.74 R5.2 | 89.41,78.74 v91.44,81.28 | 76.2,78.61 v77.47,78.74 | J6.1 62.74,78.74 | 62.74,78.74 R32.2 | J8.1 37.34,78.74 | 37.34,78.74 R39.2 | v27.94,78.74 24.64,78.74 | 24.64,78.74 R35.2 | J9.1 11.43,78.74 | 11.43,78.74 R43.2 | 62.74,78.74 v64.77,78.74 | R25.2 50.04,78.74 | 50.04,78.74 v53.34,78.74 | 37.34,78.74 v40.64,78.74 | v15.24,78.74 11.43,78.74 | J7.1 24.64,78.74 | J5.1 50.04,78.74
  Bottom 0.305: C3.+ IC2.1 7.62,53.34 7.62,67.31 12.19,67.31 J9.1
  Bottom 0.406: J2.1 103.38,77.47 103.38,83.82 91.44,83.82 | 78.74,83.82 64.77,83.82 | 64.77,83.82 53.34,83.82 | 53.34,83.82 40.64,83.82 | 40.64,83.82 27.94,83.82 | 27.94,83.82 15.24,83.82 v15.24,78.74 | v77.47,78.74 78.74,80.01 78.74,83.82 | v64.77,78.74 64.77,83.82 | v53.34,78.74 53.34,83.82 | v40.64,78.74 40.64,83.82 | v27.94,78.74 27.94,83.82 | C17.1 11.4,48.77 | 78.74,83.82 91.44,83.82 | v91.44,81.28 91.44,83.82
  Bottom 1.016: 5V.1 11.4,48.77 IC2.1

### Text on the board
tNames: GND / RESET | 8 x LED Treiber 10W / v.01 04/17 / moritz@sonicrobots.com | +12V | GND